# Altium schematic sheet Sheet1.SchDoc
size A
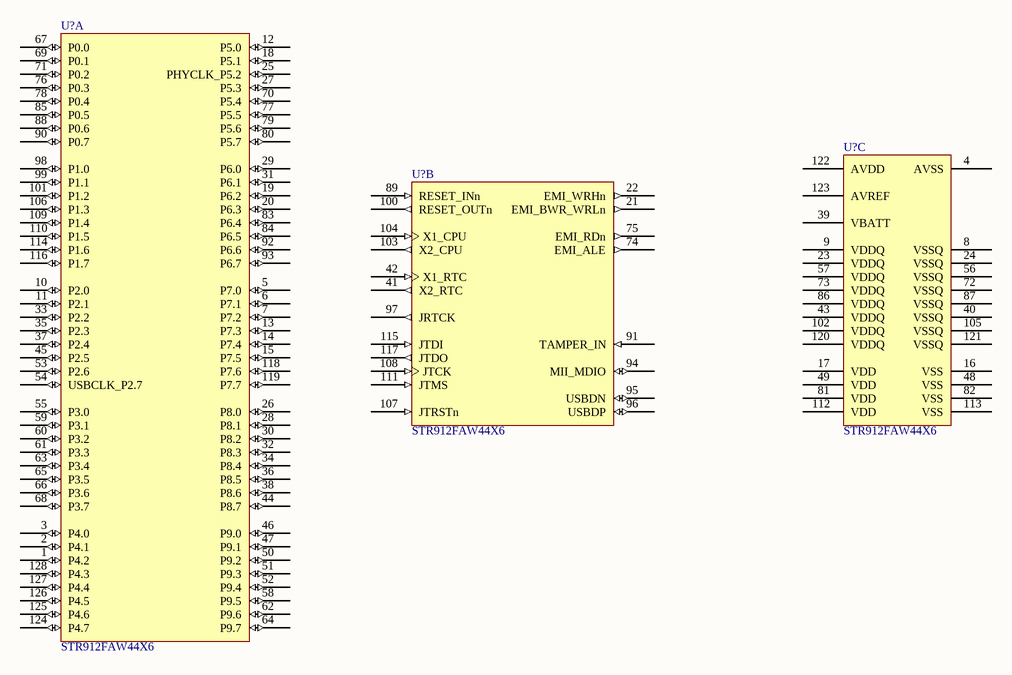
[diagram p0: Sheet1.SchDoc]

## Parts
(Parts that share a designator on the sheet are numbered #1, #2 ... from top to bottom, then left to right.)
U?#1  STR912FAW44X6  [LQFP128_N]  (part A of 3)
U?#2  STR912FAW44X6  [LQFP128_N]  (part C of 3)
U?#3  STR912FAW44X6  [LQFP128_N]  (part B of 3)

## Nets

Not connected (* = marked no-connect by the designer): U?#1 1(P4.2) 2(P4.1) 3(P4.0) 5(P7.0) 6(P7.1) 7(P7.2) 10(P2.0) 11(P2.1) 12(P5.0) 13(P7.3) 14(P7.4) 15(P7.5) 18(P5.1) 19(P6.2) 20(P6.3) 25(PHYCLK_P5.2) 26(P8.0) 27(P5.3) 28(P8.1) 29(P6.0) 30(P8.2) 31(P6.1) 32(P8.3) 33(P2.2) 34(P8.4) 35(P2.3) 36(P8.5) 37(P2.4) 38(P8.6) 44(P8.7) 45(P2.5) 46(P9.0) 47(P9.1) 50(P9.2) 51(P9.3) 52(P9.4) 53(P2.6) 54(USBCLK_P2.7) 55(P3.0) 58(P9.5) 59(P3.1) 60(P3.2) 61(P3.3) 62(P9.6) 63(P3.4) 64(P9.7) 65(P3.5) 66(P3.6) 67(P0.0) 68(P3.7) 69(P0.1) 70(P5.4) 71(P0.2) 76(P0.3) 77(P5.5) 78(P0.4) 79(P5.6) 80(P5.7) 83(P6.4) 84(P6.5) 85(P0.5) 88(P0.6) 90(P0.7) 92(P6.6) 93(P6.7) 98(P1.0) 99(P1.1) 101(P1.2) 106(P1.3) 109(P1.4) 110(P1.5) 114(P1.6) 116(P1.7) 118(P7.6) 119(P7.7) 124(P4.7) 125(P4.6) 126(P4.5) 127(P4.4) 128(P4.3); U?#2 4(AVSS) 8(VSSQ) 9(VDDQ) 16(VSS) 17(VDD) 23(VDDQ) 24(VSSQ) 39(VBATT) 40(VSSQ) 43(VDDQ) 48(VSS) 49(VDD) 56(VSSQ) 57(VDDQ) 72(VSSQ) 73(VDDQ) 81(VDD) 82(VSS) 86(VDDQ) 87(VSSQ) 102(VDDQ) 105(VSSQ) 112(VDD) 113(VSS) 120(VDDQ) 121(VSSQ) 122(AVDD) 123(AVREF); U?#3 21(EMI_BWR_WRLn) 22(EMI_WRHn) 41(X2_RTC) 42(X1_RTC) 74(EMI_ALE) 75(EMI_RDn) 89(RESET_INn) 91(TAMPER_IN) 94(MII_MDIO) 95(USBDN) 96(USBDP) 97(JRTCK) 100(RESET_OUTn) 103(X2_CPU) 104(X1_CPU) 107(JTRSTn) 108(JTCK) 111(JTMS) 115(JTDI) 117(JTDO)

## Library data of the parts
U?#1-U?#3 = STR912FAW44X6: ARM966E-S 16/32-Bit Flash MCU with 512 + 32 Kbytes Flash, 96 Kbytes RAM, 100-pin LQFP, Industrial Temperature; Published: 30-May-2008; DatasheetVersion: rev2, Nov-2007; PackageVersion: Apr-2008; PackageReference: LQFP128; Publisher: Altium Limited; PackageDescription: 128-Pin Low Profile Quad Flat Pack, 14 x 14 x 1.6 mm Body (LQFP128); ComponentLink1Description: Manufacturer Link; ComponentLink1URL: http://www.st.com/mcu/inchtml-pages-str9.html; ComponentLink2Description: Datasheet; ComponentLink2URL: http://www.st.com/stonline/products/literature/ds/13495.pdf